# EAGLE schematic usbMIDI2CV_MC (EAGLE 8.6.0)
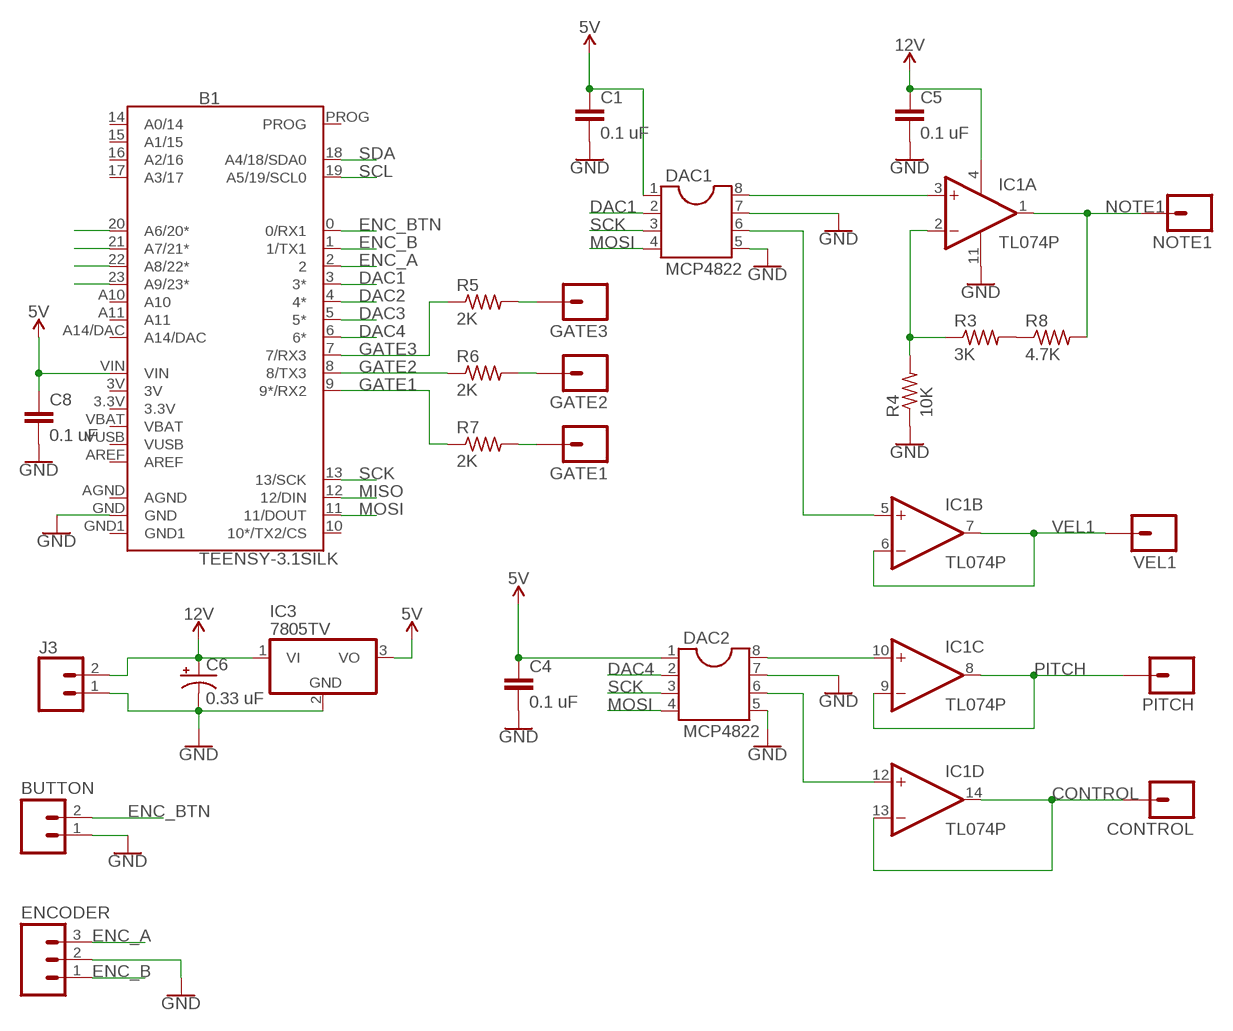
[diagram p0: schematic, sheet 1]

## Parts
B1  TEENSY-3.1SILK  [TEENSY-3.1]
BUTTON  M02LOCK_LONGPADS  [1X02_LOCK_LONGPADS]
C1  0.1 uF  CAPPTH  [CAP-PTH-SMALL]
C4  0.1 uF  CAPPTH  [CAP-PTH-SMALL]
C5  0.1 uF  CAPPTH  [CAP-PTH-SMALL]
C6  0.33 uF  CAP_POLPTH1  [CPOL-RADIAL-100UF-25V]
C8  0.1 uF  CAPPTH  [CAP-PTH-SMALL]
CONTROL  M01PTH_NO_SILK_YES_STOP  [1X01_NO_SILK]
DAC1  MCP4822  DIL8S  [SOCKET-08]
DAC2  MCP4822  DIL8S  [SOCKET-08]
ENCODER  M03LONGPADS  [1X03_LONGPADS]
GATE1  M01PTH_NO_SILK_YES_STOP  [1X01_NO_SILK]
GATE2  M01PTH_NO_SILK_YES_STOP  [1X01_NO_SILK]
GATE3  M01PTH_NO_SILK_YES_STOP  [1X01_NO_SILK]
IC1  TL074P  [DIL14]
IC3  7805TV  [TO220V]
J3  CONN_025MM  [SCREWTERMINAL-5MM-2]
NOTE1  M01PTH_NO_SILK_YES_STOP  [1X01_NO_SILK]
PITCH  M01PTH_NO_SILK_YES_STOP  [1X01_NO_SILK]
R3  3K  R-US_0207/10  [0207/10]
R4  10K  R-US_0207/10  [0207/10]
R5  2K  R-US_0207/10  [0207/10]
R6  2K  R-US_0207/10  [0207/10]
R7  2K  R-US_0207/10  [0207/10]
R8  4.7K  R-US_0207/10  [0207/10]
VEL1  M01PTH_NO_SILK_YES_STOP  [1X01_NO_SILK]

## Nets
5V: B1.VIN C1.1 C4.1 C8.1 DAC1.1 DAC2.1 IC3.3(VO)
12V: C5.1 C6.1(+) IC1.4(P:V+) IC3.1(VI) J3.2
CONTROL: CONTROL.1 IC1.13(D:-IN) IC1.14(D:OUT)
DAC1: B1.3(3*) DAC1.2
DAC2: B1.4(4*)
DAC3: B1.5(5*)
DAC4: B1.6(6*) DAC2.2
ENC_A: B1.2 ENCODER.3
ENC_B: B1.1(1/TX1) ENCODER.1
ENC_BTN: B1.0(0/RX1) BUTTON.2
GATE1: B1.9(9*/RX2) R7.1
GATE2: B1.8(8/TX3) R6.1
GATE3: B1.7(7/RX3) R5.1
GND: B1.GND BUTTON.1 C1.2 C4.2 C5.2 C6.2(-) C8.2 DAC1.5 DAC1.7 DAC2.5 DAC2.7 ENCODER.2 IC1.11(P:V-) IC3.2(GND) J3.1 R4.1
MISO: B1.12(12/DIN)
MOSI: B1.11(11/DOUT) DAC1.4 DAC2.4
N$4: DAC1.8 IC1.3(A:+IN)
N$5: R3.2 R8.1
N$6: IC1.2(A:-IN) R3.1 R4.2
N$7: DAC1.6 IC1.5(B:+IN)
N$14: DAC2.6 IC1.12(D:+IN)
N$15: DAC2.8 IC1.10(C:+IN)
N$16: GATE3.1 R5.2
N$17: GATE2.1 R6.2
N$18: B1.20(A6/20*)
N$19: B1.21(A7/21*)
N$20: B1.22(A8/22*)
N$21: B1.23(A9/23*)
N$22: GATE1.1 R7.2
NOTE1: IC1.1(A:OUT) NOTE1.1 R8.2
PITCH: IC1.8(C:OUT) IC1.9(C:-IN) PITCH.1
SCK: B1.13(13/SCK) DAC1.3 DAC2.3
SCL: B1.19(A5/19/SCL0)
SDA: B1.18(A4/18/SDA0)
VEL1: IC1.6(B:-IN) IC1.7(B:OUT) VEL1.1
Unconnected: B1.10(10*/TX2/CS) B1.14(A0/14) B1.15(A1/15) B1.16(A2/16) B1.17(A3/17) B1.A10 B1.A11 B1.A14/DAC B1.AREF B1.PROG

## Power pins joined to a net without a drawn wire
3.3V: B1.3.3V
3V: B1.3V
AGND: B1.AGND
GND1: B1.GND1
VBAT: B1.VBAT
VUSB: B1.VUSB

## Library data of the parts
B1 = SparkFun-Boards:TEENSY-3.1: Teensy 3+ Footprint Mechanical footprint with connectors for Teensy Development Board with ARM Cortex. SparkFun Products: Teensy 3.2 <https://www.sparkfun.com/products/13736> Teensy LC <https://www.sparkfun.com/products/13305>; SF_ID: DEV-12646
BUTTON = SparkFun-Connectors:M02: Standard 2-pin 0.1" header. Use with - straight break away headers ( PRT-00116) - right angle break away headers (PRT-00553) - swiss pins (PRT-00743) - machine pins (PRT-00117) - female headers (PRT-00115) Molex polarized connector foot print use with: PRT-08233 with associated crimp pins and housings. 2.54_SCREWTERM for use with PRT-10571. 3.5mm Screw Terminal footprints for PRT-08084 5mm Screw Terminal footprints for use with PRT-08432
C1 C4 C5 C8 = SparkFun-Capacitors:CAP: Capacitor Standard 0603 ceramic capacitor, and 0.1" leaded capacitor.
C6 = SparkFun-Capacitors:CAP_POL: Capacitor Polarized These are standard SMD and PTH capacitors. Normally 10uF, 47uF, and 100uF in electrolytic and tantalum varieties. Always verify the external diameter of the through hole cap, it varies with capacity, voltage, and manufacturer. The EIA devices should be standard.
CONTROL GATE1-GATE3 NOTE1 PITCH VEL1 = SparkFun-Connectors:M01: Header 1 Standard 1-pin 0.1" header. Use with straight break away headers (SKU : PRT-00116), right angle break away headers (PRT-00553), swiss pins (PRT-00743), machine pins (PRT-00117), and female headers (PRT-00115). SMTSO-256-ET is a "flush mount" nut for a 4-40 screw. The older package used to be too tight, and did not allow it to sit properly thru the drill hit. The latest (0.165DIA) fits nice and snug.
DAC1 DAC2 = ic-package:DIL8: Dual In Line / Socket; SPICEPREFIX: X
ENCODER = SparkFun-Connectors:M03: Header 3 Standard 3-pin 0.1" header. Use with straight break away headers (SKU : PRT-00116), right angle break away headers (PRT-00553), swiss pins (PRT-00743), machine pins (PRT-00117), and female headers (PRT-00115). Molex polarized connector foot print use with SKU : PRT-08232 with associated crimp pins and housings.
IC1 = linear:TL074: OP AMP
IC3 = linear:78*: Positive VOLTAGE REGULATOR Source: http://cache.national.com/ds/LM/LM78L05.pdf http://www.fairchildsemi.com/ds/LM/LM7805.pdf
J3 = SparkFun-Connectors:CONN_02: Multi connection point. Often used as Generic Header-pin footprint for 0.1 inch spaced/style header connections On any of the 0.1 inch spaced packages, you can populate with these: Break Away Headers - Straight <https://www.sparkfun.com/products/116> (PRT-00116) Break Away Male Headers - Right Angle <https://www.sparkfun.com/products/553> (PRT-00553) Female Headers <https://www.sparkfun.com/products/115> (PRT-00115) Break Away Headers - Machine Pin <https://www.sparkfun.com/products/117> (PRT-00117) Break Away Female Headers - Swiss Machine Pin <https://www.sparkfun.com/products/743> (PRT-00743) For SCREWTERMINALS and SPRING TERMINALS visit here: Screw Terimnals on SparkFun.com <https://www.sparkfun.com/search/results?term=Screw+Terminals> (5mm/3.5mm/2.54mm spacing) This device is also useful as a general connection point to wire up your design to another part of your project. Our various solder wires solder well into these plated through hole pads. Hook-Up Wire - Assortment (Stranded, 22 AWG) <https://www.sparkfun.com/products/11375> (PRT-11375) Hook-Up Wire - Assortment (Solid Core, 22 AWG) <https://www.sparkfun.com/products/11367> (PRT-11367) View the entire wire category on our website here <https://www.sparkfun.com/categories/141> Special notes: Molex polarized connector foot print use with: PRT-08233 with associated crimp pins and housings. 2.54_SCREWTERM for use with PRT-10571. 3.5mm Screw Terminal footprints for PRT-08084 5mm Screw Terminal footprints for use with PRT-08432; SF_SKU: PRT-08432
R3-R8 = resistor:R-US_: RESISTOR, American symbol